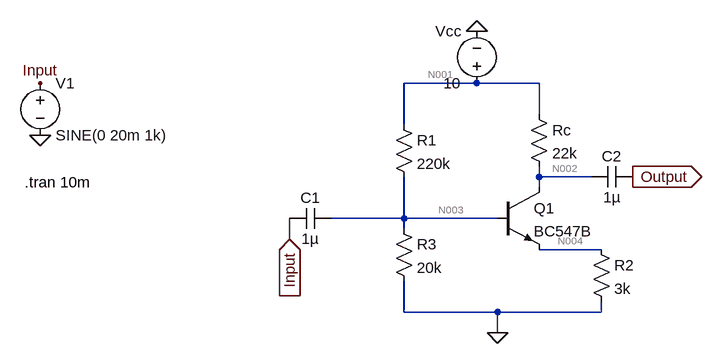
[diagram p0: schematic ce_amplifier.asc]
ce_amplifier.asc, the LTspice schematic file:
Version 4
SHEET 1 880 680
WIRE 192 80 80 80
WIRE 288 80 192 80
WIRE 288 128 288 80
WIRE 80 144 80 80
WIRE 288 224 288 208
WIRE 368 224 288 224
WIRE 288 240 288 224
WIRE 80 288 80 224
WIRE 80 288 -32 288
WIRE 224 288 80 288
WIRE 80 304 80 288
WIRE -96 320 -96 288
WIRE 384 336 288 336
WIRE 80 432 80 384
WIRE 224 432 80 432
WIRE 384 432 384 416
WIRE 384 432 224 432
WIRE 224 464 224 432
FLAG 224 464 0
FLAG 192 0 0
FLAG -96 320 Input
IOPIN -96 320 In
FLAG 432 224 Output
IOPIN 432 224 Out
FLAG -480 160 0
FLAG -480 80 Input
SYMBOL voltage 192 96 R180
WINDOW 0 24 96 Left 2
WINDOW 3 24 16 Left 2
WINDOW 123 0 0 Left 0
WINDOW 39 0 0 Left 0
SYMATTR InstName Vcc
SYMATTR Value 10
SYMBOL res 64 128 R0
SYMATTR InstName R1
SYMATTR Value 220k
SYMBOL res 272 112 R0
SYMATTR InstName Rc
SYMATTR Value 22k
SYMBOL res 64 288 R0
SYMATTR InstName R3
SYMATTR Value 20k
SYMBOL npn 224 240 R0
SYMATTR InstName Q1
SYMATTR Value BC547B
SYMBOL cap -32 272 R90
WINDOW 0 0 32 VBottom 2
WINDOW 3 32 32 VTop 2
SYMATTR InstName C1
SYMATTR Value 1µ
SYMBOL cap 432 208 R90
WINDOW 0 0 32 VBottom 2
WINDOW 3 32 32 VTop 2
SYMATTR InstName C2
SYMATTR Value 1µ
SYMBOL voltage -480 64 R0
WINDOW 123 0 0 Left 0
WINDOW 39 0 0 Left 0
SYMATTR InstName V1
SYMATTR Value SINE(0 20m 1k)
SYMBOL res 368 320 R0
SYMATTR InstName R2
SYMATTR Value 3k
TEXT -504 232 Left 2 !.tran 10m

The netlist it stands for:
* ce_amplifier.asc
Vcc N001 0 10
R1 N001 N003 220k
Rc N001 N002 22k
R3 N003 0 20k
Q1 N002 N003 N004 0 BC547B
C1 N003 Input 1µ
C2 Output N002 1µ
V1 Input 0 SINE(0 20m 1k)
R2 N004 0 3k
.model NPN NPN
.model PNP PNP
.lib standard.bjt
.tran 10m
.backanno
.end

* Results of the author's LTspice run, read from the files saved beside the schematic
* Operating Point, zero values left out:
*   V(n001) = 10 V
*   V(n003) = 828.4 mV
*   V(n002) = 8.12 V
*   V(n004) = 257.1 mV
*   V(output) = 8.12 µV
*   Ic(Q1) = 85.43 µA
*   Ib(Q1) = 271.6 nA
*   Ie(Q1) = -85.71 µA
*   I(R1) = 41.69 µA
*   I(Rc) = 85.43 µA
*   I(R3) = 41.42 µA
*   I(R2) = 85.71 µA
*   I(Vcc) = -127.1 µA
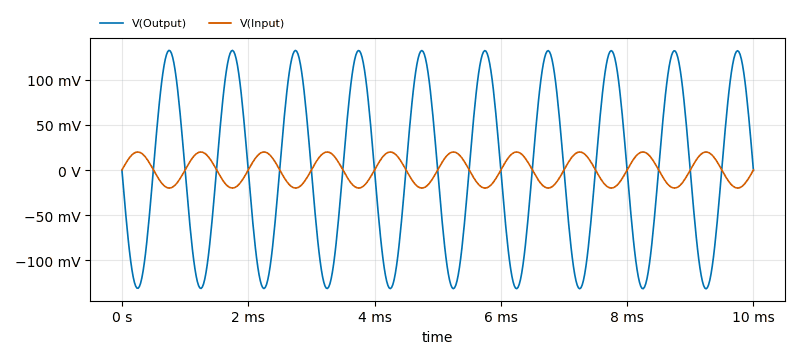
[diagram p1: Transient Analysis of ce_amplifier.asc, plotted from the saved traces]
* Transient Analysis, 1 run:
*   V(Output): min -131.9 mV, max 132.8 mV, average 691.9 µV, rms 93.46 mV, last -448.6 µV
*   V(Input): min -20 mV, max 20 mV, average -9.637 nV, rms 14.14 mV, last 0 V